# EAGLE design USBHume2 (EAGLE 7.5.0)
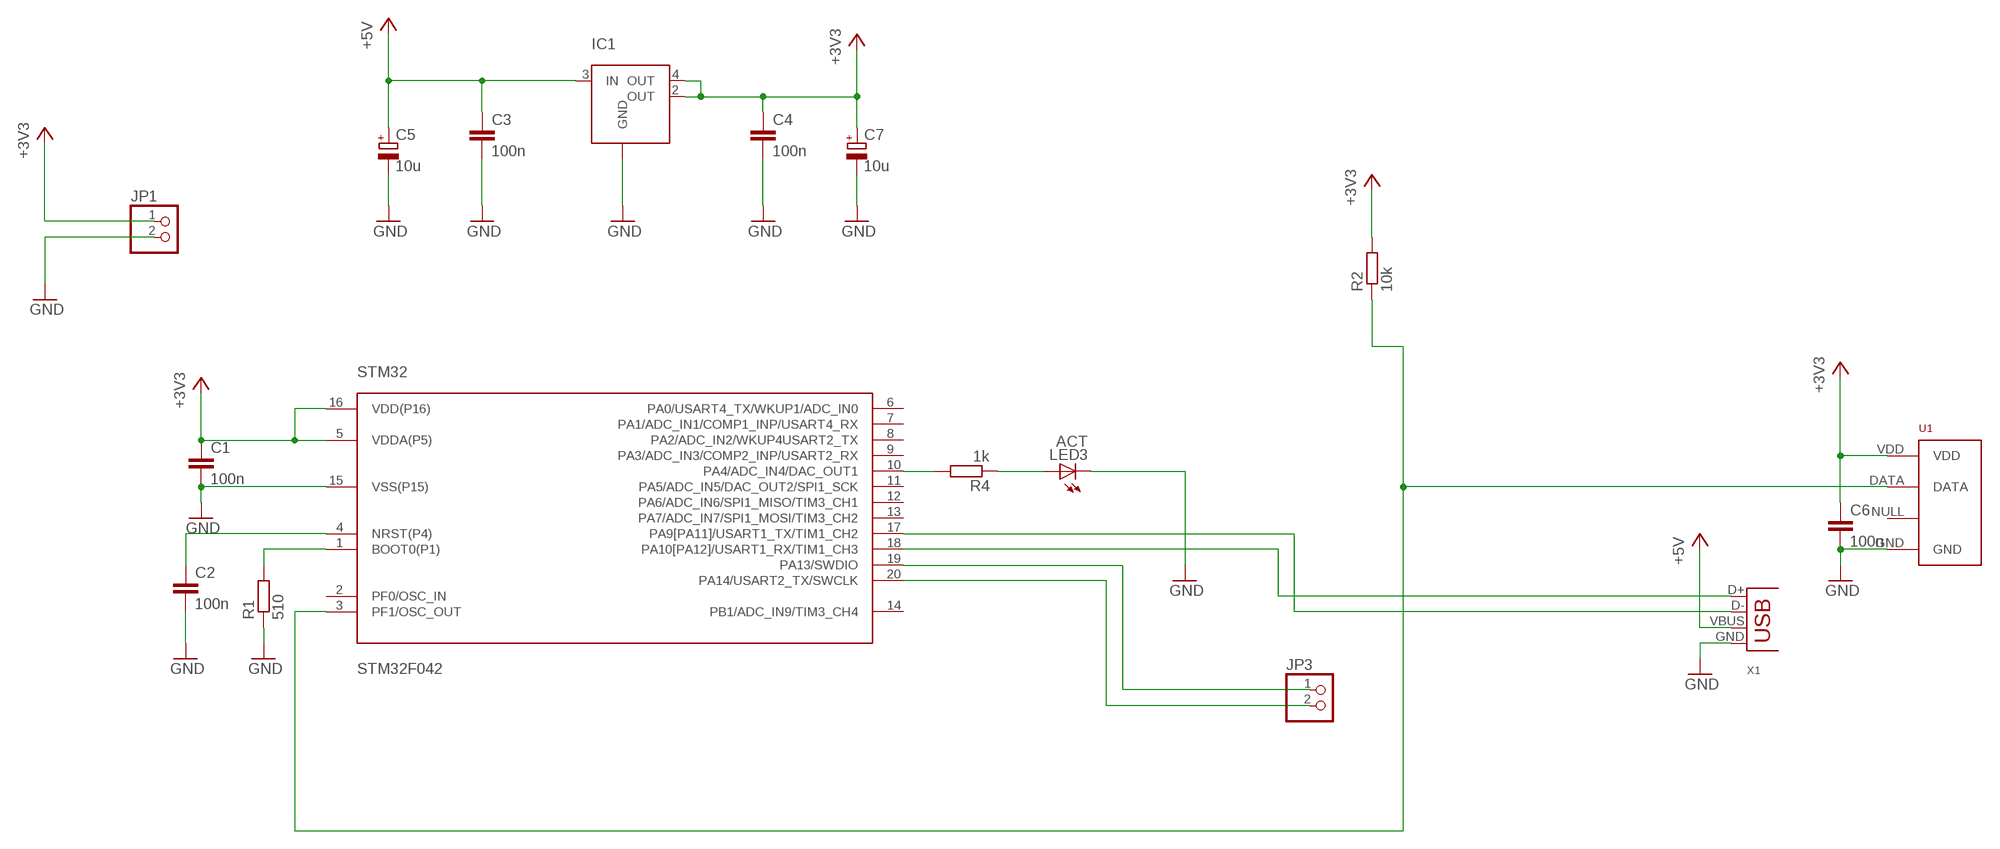
[diagram p0: schematic, sheet 1]

## Parts
C1  100n  C-EUC1206K  [C1206K]
C2  100n  C-EUC1206K  [C1206K]
C3  100n  C-EUC1206K  [C1206K]
C4  100n  C-EUC1206K  [C1206K]
C5  10u  CPOL-EUC/6032-28R  [C/6032-28R]
C6  100n  C-EUC1206K  [C1206K]
C7  10u  CPOL-EUC/6032-28R  [C/6032-28R]
IC1  LM1117MP-3.3  [SOT223]
JP1  PINHD-1X2  [1X02]
JP3  PINHD-1X2  [1X02]
LED3  ACT  LEDCHIPLED_0805  [CHIPLED_0805]
R1  510  R-EU_M0805  [M0805]
R2  10k  R-EU_M0805  [M0805]
R4  1k  R-EU_M0805  [M0805]
STM32  STM32F042  [TSSOP20]
U1  RHT03_DHT-22_AM2302WIRED  [AM2302]
X1  USB-A-H  [USB-A-H]

## Nets
+3V3: C1.1 C4.1 C6.1 C7.+ IC1.2(OUT) IC1.4(OUT) JP1.1 R2.2 STM32.5(VDDA(P5)) STM32.16(VDD(P16)) U1.VDD
+5V: C3.1 C5.+ IC1.3(IN) X1.VBUS
GND: C1.2 C2.2 C3.2 C4.2 C5.- C6.2 C7.- IC1.1(GND) JP1.2 LED3.C R1.1 STM32.15(VSS(P15)) U1.GND X1.GND
N$1: R2.1 STM32.3(PF1/OSC_OUT) U1.DATA
N$2: R4.2 STM32.10(PA4/ADC_IN4/DAC_OUT1)
N$3: STM32.17(PA9[PA11]/USART1_TX/TIM1_CH2) X1.D-
N$5: STM32.18(PA10[PA12]/USART1_RX/TIM1_CH3) X1.D+
N$7: R1.2 STM32.1(BOOT0(P1))
N$9: JP3.1 STM32.19(PA13/SWDIO)
N$10: JP3.2 STM32.20(PA14/USART2_TX/SWCLK)
N$14: LED3.A R4.1
N$15: C2.1 STM32.4(NRST(P4))
Unconnected: STM32.2(PF0/OSC_IN) STM32.6(PA0/USART4_TX/WKUP1/ADC_IN0) STM32.7(PA1/ADC_IN1/COMP1_INP/USART4_RX) STM32.8(PA2/ADC_IN2/WKUP4USART2_TX) STM32.9(PA3/ADC_IN3/COMP2_INP/USART2_RX) STM32.11(PA5/ADC_IN5/DAC_OUT2/SPI1_SCK) STM32.12(PA6/ADC_IN6/SPI1_MISO/TIM3_CH1) STM32.13(PA7/ADC_IN7/SPI1_MOSI/TIM3_CH2) STM32.14(PB1/ADC_IN9/TIM3_CH4) U1.NULL

## Library data of the parts
C1-C4 C6 = rcl:C-EU: CAPACITOR, European symbol
C5 C7 = rcl:CPOL-EU: POLARIZED CAPACITOR, European symbol
IC1 = lm1117mp:LM1117MP-3.3
JP1 JP3 = pinhead:PINHD-1X2: PIN HEADER
LED3 = led:LED: LED OSRAM: - CHIPLED LG R971, LG N971, LY N971, LG Q971, LY Q971, LO R971, LY R971 LH N974, LH R974 LS Q976, LO Q976, LY Q976 LO Q996 - Hyper CHIPLED LW Q18S LB Q993, LB Q99A, LB R99A - SideLED LS A670, LO A670, LY A670, LG A670, LP A670 LB A673, LV A673, LT A673, LW A673 LH A674 LY A675 LS A676, LA A676, LO A676, LY A676, LW A676 LS A679, LY A679, LG A679 - Hyper Micro SIDELED® LS Y876, LA Y876, LO Y876, LY Y876 LT Y87S - SmartLED LW L88C, LW L88S LB L89C, LB L89S, LG L890 LS L89K, LO L89K, LY L89K LS L896, LA L896, LO L896, LY L896 - TOPLED LS T670, LO T670, LY T670, LG T670, LP T670 LSG T670, LSP T670, LSY T670, LOP T670, LYG T670 LG T671, LOG T671, LSG T671 LB T673, LV T673, LT T673, LW T673 LH T674 LS T676, LA T676, LO T676, LY T676, LB T676, LH T676, LSB T676, LW T676 LB T67C, LV T67C, LT T67C, LS T67K, LO T67K, LY T67K, LW E67C LS E67B, LA E67B, LO E67B, LY E67B, LB E67C, LV E67C, LT E67C LW T67C LS T679, LY T679, LG T679 LS T770, LO T770, LY T770, LG T770, LP T770 LB T773, LV T773, LT T773, LW T773 LH T774 LS E675, LA E675, LY E675, LS T675 LS T776, LA T776, LO T776, LY T776, LB T776 LHGB T686 LT T68C, LB T68C - Hyper Mini TOPLED® LB M676 - Mini TOPLED Santana® LG M470 LS M47K, LO M47K, LY M47K Source: http://www.osram.convergy.de LUXEON: - LUMILED® LXK2-PW12-R00, LXK2-PW12-S00, LXK2-PW14-U00, LXK2-PW14-V00 LXK2-PM12-R00, LXK2-PM12-S00, LXK2-PM14-U00 LXK2-PE12-Q00, LXK2-PE12-R00, LXK2-PE12-S00, LXK2-PE14-T00, LXK2-PE14-U00 LXK2-PB12-K00, LXK2-PB12-L00, LXK2-PB12-M00, LXK2-PB14-N00, LXK2-PB14-P00, LXK2-PB14-Q00 LXK2-PR12-L00, LXK2-PR12-M00, LXK2-PR14-Q00, LXK2-PR14-R00 LXK2-PD12-Q00, LXK2-PD12-R00, LXK2-PD12-S00 LXK2-PH12-R00, LXK2-PH12-S00 LXK2-PL12-P00, LXK2-PL12-Q00, LXK2-PL12-R00 Source: www.luxeon.com KINGBRIGHT: KA-3528ASYC Source: www.kingbright.com
R1 R2 R4 = rcl:R-EU_: RESISTOR, European symbol
STM32 = stm32f0:STM32F042
U1 = RHT03_DHT-22_AM2302:RHT03_DHT-22_AM2302: RHT03 / DHT-22 / AM2302 Packages and symbol for the RHT03 / DHT-22 relative humidity and temperature sensor. Note: The AM2302 is a wired version of the DHT-22 which typically requires less clearance and is thus provided as a separate package.; PROD_ID: SEN-10167
X1 = con-usb-3:USB: USB Connectors

## Board
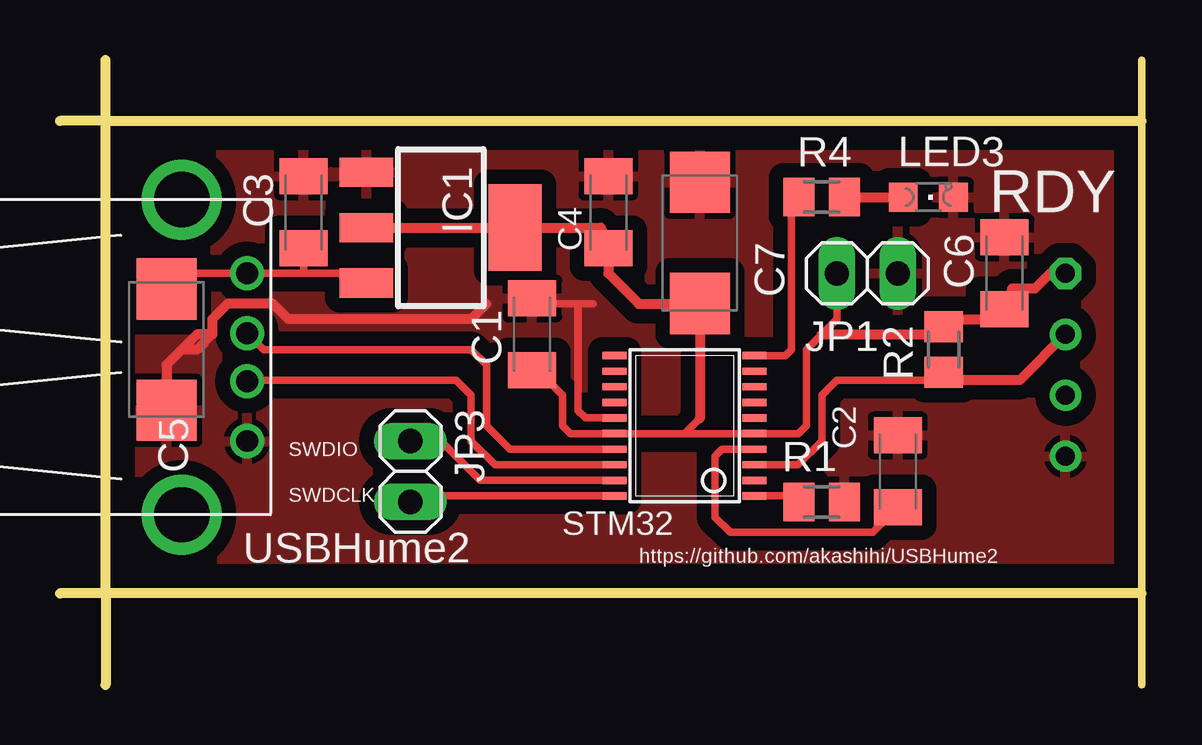
[diagram p1: board, top side]
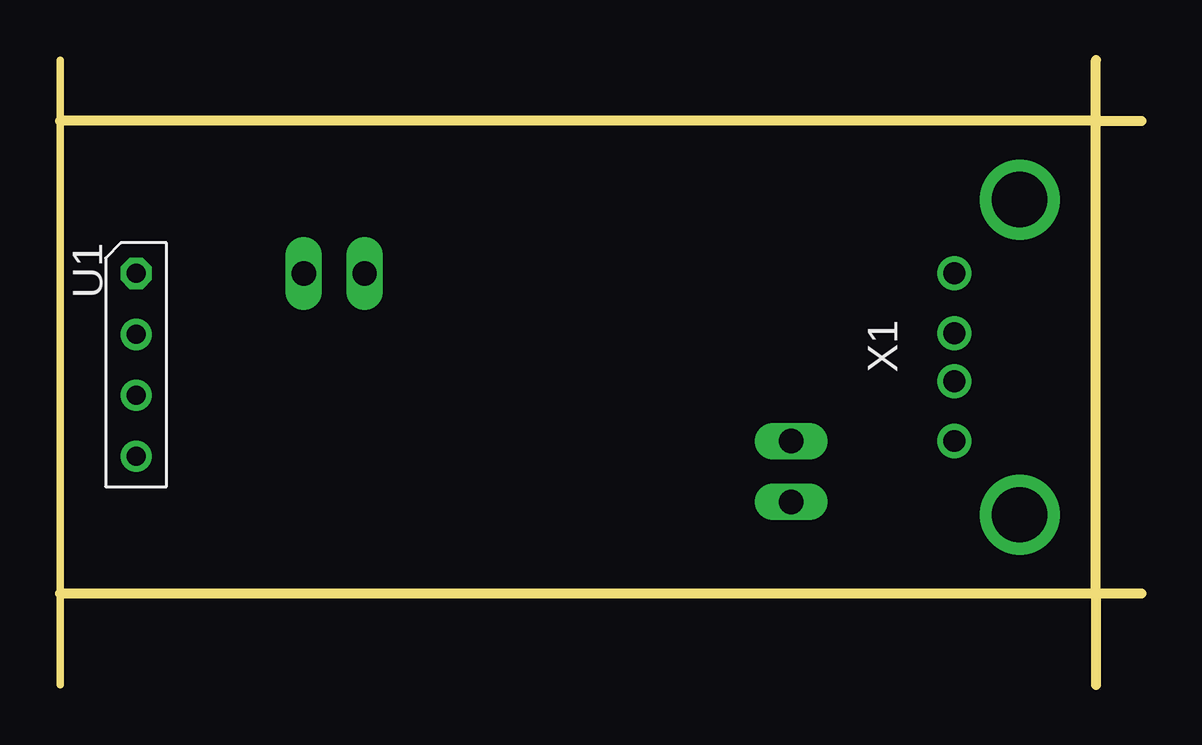
[diagram p2: board, bottom side, seen from below]

Size 45.09 x 26.04 mm. Coordinates in mm from the lower left corner, seen from the top.
Outline: 1.91,3.81 1.91,23.5
Outline: 1.91,23.5 45.09,23.5
Outline: 45.09,3.81 1.91,3.81
Outline: 1.91,23.5 1.91,26.04
Outline: 1.91,23.5 0,23.5
Outline: 1.91,3.81 1.91,0
Outline: 1.91,3.81 0,3.81
Outline: 45.09,26.04 45.09,23.5
Outline: 45.09,23.5 45.09,0
Copper layers (1*16): Top 0.035mm / dielectric 1.5mm / Bottom 0.035mm
Design rules "elekon": minimum track width 10mil, minimum drill 24mil, track to track 0.3mm, track to pad 0.3mm, pad to pad 0.3mm, via to via 0.3mm, smd to smd 0.3mm, copper to edge 40mil, drill to drill 8mil, minimum pad ring 10mil, minimum via ring 8mil, stop-mask expansion 4mil, vias tented up to drill 0mil, thermal gap 10mil

### Footprints (pad centres in the part's own frame; a part is rotated, then mirrored left to right if it is on the bottom)
C1206K = smd 1.5 x 2: 1 -1.5,0; 2 1.5,0
C/6032-28R = smd 2.55 x 2.5: + 2.525,0; - -2.525,0
SOT223 = smd 1.219 x 2.235: 1 -2.311,-3.099; 2 0,-3.099; 3 2.311,-3.099 | smd 3.6 x 2.2: 4 0,3.099
1X02 = drill 1.016 long: 1 -1.27,0; 2 1.27,0
CHIPLED_0805 = smd 1.2 x 1.2: A 0,-1.05; C 0,1.05
M0805 = smd 1.3 x 1.6: 1 -0.95,0; 2 0.95,0
TSSOP20 = smd 0.305 x 0.991: 1 -2.925,-2.918; 2 -2.275,-2.918; 3 -1.625,-2.918; 4 -0.975,-2.918; 5 -0.325,-2.918; 6 0.325,-2.918; 7 0.975,-2.918; 8 1.625,-2.918; 9 2.275,-2.918; 10 2.925,-2.918; 11 2.925,2.918; 12 2.275,2.918; 13 1.625,2.918; 14 0.975,2.918; 15 0.325,2.918; 16 -0.325,2.918; 17 -0.975,2.918; 18 -1.625,2.918; 19 -2.275,2.918; 20 -2.925,2.918
AM2302 = drill 0.8: DATA -1.27,0; GND 3.81,0; NULL 1.27,0 | drill 0.8 octagon: VDD -3.81,0
USB-A-H = drill 0.914: D+ 2.718,-1.003; D- 2.718,1.003; GND 2.718,-3.493; VBUS 2.718,3.493 | drill 2.311: P$5 0,-6.566; P$6 0,6.566

### Placement (x,y rotation side)
C1  19.68,14.61 90 top
C2  34.92,8.89 90 top
C3  10.16,19.68 90 top
C4  22.86,19.68 90 top
C5  4.45,13.97 90 top
C6  39.37,17.14 90 top
C7  26.67,18.41 270 top
IC1  15.88,19.05 270 top
JP1  33.66,17.14 0 top
JP3  14.61,8.89 270 top
LED3  36.2,20.32 270 top
R1  31.75,7.62 180 top
R2  36.83,13.97 90 top
R4  31.75,20.32 180 top
STM32  26.04,10.79 90 top
U1  41.91,13.34 270 bottom
X1  5.08,13.65 0 top

### Tracks (layer width: path | path; a pad name or v marks a point on that pad's centre or on a via)
+3V3
  Top 0.305: C1.1 20.09,12.7 20.32,12.7 20.95,12.06 20.95,10.79 21.28,10.47 STM32.16 26.04,10.47 | 26.04,10.47 STM32.5 30.79,10.47 31.11,10.79 31.11,13.97 31.75,14.61 32.38,15.24 JP1.1 | 26.67,11.11 26.04,10.47
  Top 0.406: IC1.2 IC1.4 22.55,19.05 C4.1 22.86,17.14 24.13,15.88 26.66,15.88 C7.+ 26.67,11.11 | U1.VDD 41.27,17.14 40.64,16.51 39.69,16.51 C6.1 38.41,15.24 36.83,15.24 R2.2 36.52,14.61 31.75,14.61
+5V
  Top 0.305: 11.73,17.14 10.16,17.14 | 10.16,17.14 X1.VBUS 5.09,17.14 C5.+ | C3.1 10.16,17.14
  Top 0.406: 11.73,17.14 IC1.3
GND
  Top 0.305: 22.23,15.88 21.59,15.88 | 21.59,15.88 20.55,15.88 C1.2 | STM32.15 21.9,11.12 21.59,11.43 21.59,15.88
  Top 0.406: 17.78,15.88 17.14,15.24 9.53,15.24 8.89,15.88 6.99,15.88 6.35,15.24 6.35,14.61 | 6.35,14.61 5.71,13.97 5.08,13.97 | 5.08,13.97 4.45,13.34 C5.- | 6.35,14.61 5.71,14.61 5.08,13.97
  pour Top (isolate 0.61): 1.91,23.5 45.09,23.5 45.09,3.81 1.91,3.81
N$1
  Top 0.305: STM32.3 30.76,9.17 31.75,10.16 31.75,12.06 32.38,12.7 36.51,12.7 R2.1
  Top 0.406: 36.52,13.34 R2.1 37.15,12.7 40.01,12.7 U1.DATA
N$2
  Top 0.305: STM32.10 30.23,13.72 30.48,13.97 30.48,20.32
  Top 0.406: 30.8,20.07 R4.2 | R4.2 31.11,20.32 | R4.2 30.48,20.32
N$3
  Top 0.305: STM32.17 18.75,9.82 17.78,10.79 17.78,13.34 17.14,13.97 8.48,13.97 X1.D-
N$5
  Top 0.305: STM32.18 18.14,9.17 17.14,10.16 17.14,12.06 16.51,12.7 7.85,12.7 X1.D+
N$7
  Top 0.305: STM32.1 30.55,7.87 R1.2
N$9
  Top 0.305: STM32.19 17.52,8.52 15.88,10.16 JP3.1
N$10
  Top 0.305: STM32.20 15.49,7.87 JP3.2
N$14
  Top 0.406: R4.1 LED3.A
N$15
  Top 0.305: STM32.4 27.6,9.82 27.3,9.53 27.3,6.99 27.94,6.35 33.88,6.35 C2.1

### Text on the board
tNames: RDY | SWDIO | SWDCLK | USBHume2 | https://github.com/akashihi/USBHume2